# Altium schematic sheet Cortex.SchDoc: LPC4337 - Port 0-3
size A4; Author: Andreas Rehn; CompanyName: Hochschule Ulm; DrawnBy: Andreas Rehn; Engineer: Andreas Rehn; Organization: Hochschule Ulm; Address1: Institut für Medizintechnik; Address2: und Mechatronik; Address3: Albert-Einstein-Allee 55; Address4: 89081 Ulm; SheetNumber: 7; SheetTotal: 11
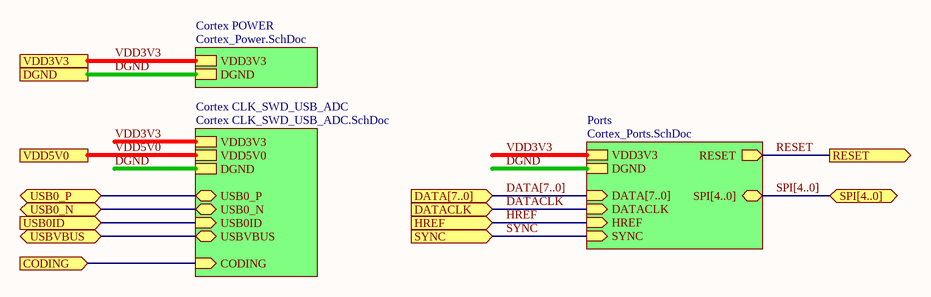
[diagram p0: Cortex.SchDoc]

## Sub-sheets
Cortex CLK_SWD_USB_ADC = Cortex CLK_SWD_USB_ADC.SchDoc: USB0_P (bidir), USB0_N (bidir), USB0ID (in), VDD3V3, DGND, USBVBUS (bidir), CODING (in), VDD5V0
Cortex POWER = Cortex_Power.SchDoc: VDD3V3, DGND
Ports = Cortex_Ports.SchDoc: DATA[7..0] (in), VDD3V3, DGND, DATACLK (in), HREF (in), RESET (out), SYNC (in), SPI[4..0] (bidir)

## Ports
CODING (in), DATA[7..0] (in), DATACLK (in), DGND, HREF (in), RESET (out), SPI[4..0] (bidir), SYNC (in), USB0_N (bidir), USB0_P (bidir), USB0ID (in), USBVBUS (bidir), VDD3V3, VDD5V0

## Nets
CODING: port CODING, sheet Cortex CLK_SWD_USB_ADC/CODING
DATACLK: port DATACLK, sheet Ports/DATACLK
DGND: port DGND, sheet Cortex POWER/DGND, sheet Cortex CLK_SWD_USB_ADC/DGND, sheet Ports/DGND
HREF: port HREF, sheet Ports/HREF
RESET: port RESET, sheet Ports/RESET
SYNC: port SYNC, sheet Ports/SYNC
USB0_N: port USB0_N, sheet Cortex CLK_SWD_USB_ADC/USB0_N
USB0_P: port USB0_P, sheet Cortex CLK_SWD_USB_ADC/USB0_P
USB0ID: port USB0ID, sheet Cortex CLK_SWD_USB_ADC/USB0ID
USBVBUS: port USBVBUS, sheet Cortex CLK_SWD_USB_ADC/USBVBUS
VDD3V3: port VDD3V3, sheet Cortex POWER/VDD3V3, sheet Cortex CLK_SWD_USB_ADC/VDD3V3, sheet Ports/VDD3V3
VDD5V0: port VDD5V0, sheet Cortex CLK_SWD_USB_ADC/VDD5V0

## Buses and harness runs
bus DATA[7..0] = port DATA[7..0] = sheet Ports/DATA[7..0]
bus SPI[4..0] = port SPI[4..0] = sheet Ports/SPI[4..0]

## Notes on the sheet
- Project
- Ultrasonic Doppler 2015
- Title
- Size:
- Date:
- A4
- Number:
- Time:
- Revision:
- Sheet
- of
- Eng: